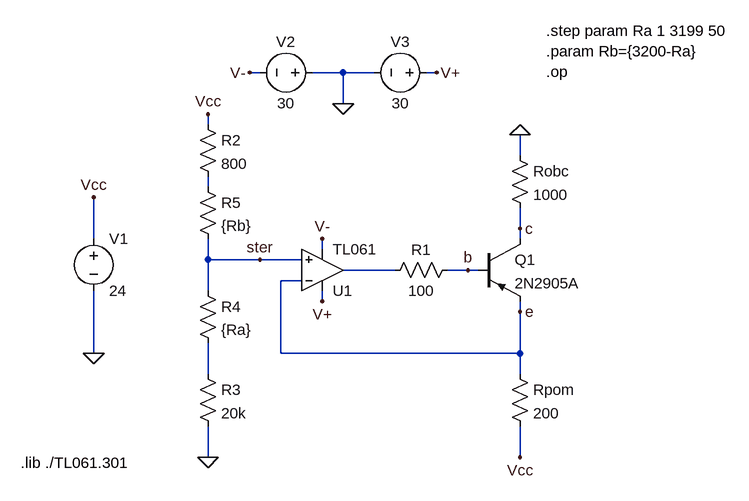
[diagram p0: schematic PNP.asc]
PNP.asc, the LTspice schematic file:
Version 4
SHEET 1 1128 680
WIRE 384 -272 368 -272
WIRE 512 -272 464 -272
WIRE 560 -272 512 -272
WIRE 656 -272 640 -272
WIRE 512 -224 512 -272
WIRE 304 -192 304 -208
WIRE 784 -144 784 -176
WIRE 304 -96 304 -112
WIRE 784 -32 784 -64
WIRE 128 -16 128 -80
WIRE 784 -16 784 -32
WIRE 480 0 480 -16
WIRE 304 16 304 -16
WIRE 384 16 304 16
WIRE 448 16 384 16
WIRE 592 32 512 32
WIRE 704 32 672 32
WIRE 720 32 704 32
WIRE 448 48 416 48
WIRE 304 64 304 16
WIRE 480 80 480 64
WIRE 784 96 784 80
WIRE 128 160 128 64
WIRE 416 160 416 48
WIRE 784 160 784 96
WIRE 784 160 416 160
WIRE 304 192 304 144
WIRE 784 192 784 160
WIRE 304 320 304 272
WIRE 784 320 784 272
FLAG 128 -80 Vcc
FLAG 128 160 0
FLAG 512 -224 0
FLAG 656 -272 V+
FLAG 368 -272 V-
FLAG 480 -16 V-
FLAG 480 80 V+
FLAG 784 96 e
FLAG 784 -32 c
FLAG 704 32 b
FLAG 784 -176 0
FLAG 784 320 Vcc
FLAG 384 16 ster
FLAG 304 320 0
FLAG 304 -208 Vcc
SYMBOL voltage 128 -32 R0
WINDOW 123 0 0 Left 0
WINDOW 39 0 0 Left 0
SYMATTR InstName V1
SYMATTR Value 24
SYMBOL voltage 480 -272 R90
WINDOW 0 -32 56 VBottom 2
WINDOW 3 32 56 VTop 2
WINDOW 123 0 0 Left 0
WINDOW 39 0 0 Left 0
SYMATTR InstName V2
SYMATTR Value 30
SYMBOL voltage 656 -272 R90
WINDOW 0 -32 56 VBottom 2
WINDOW 3 32 56 VTop 2
WINDOW 123 0 0 Left 0
WINDOW 39 0 0 Left 0
SYMATTR InstName V3
SYMATTR Value 30
SYMBOL res 768 -160 R0
SYMATTR InstName Robc
SYMATTR Value 1000
SYMBOL res 768 176 R0
SYMATTR InstName Rpom
SYMATTR Value 200
SYMBOL res 688 16 R90
WINDOW 0 0 56 VBottom 2
WINDOW 3 32 56 VTop 2
SYMATTR InstName R1
SYMATTR Value 100
SYMBOL res 288 -208 R0
SYMATTR InstName R2
SYMATTR Value 800
SYMBOL res 288 176 R0
SYMATTR InstName R3
SYMATTR Value 20k
SYMBOL res 288 48 R0
SYMATTR InstName R4
SYMATTR Value {Ra}
SYMBOL res 288 -112 R0
SYMATTR InstName R5
SYMATTR Value {Rb}
SYMBOL pnp 720 -16 R0
SYMATTR InstName Q1
SYMATTR Value 2N2905A
SYMBOL OpAmps\\opamp2 480 96 M180
SYMATTR InstName U1
SYMATTR Value TL061
TEXT 16 328 Left 2 !.lib ./TL061.301
TEXT 824 -336 Left 2 !.step param Ra 1 3199 50\n.param Rb={3200-Ra}\n.op

The netlist it stands for:
* PNP.asc
V1 Vcc 0 24
V2 0 V- 30
V3 V+ 0 30
Robc 0 c 1000
Rpom e Vcc 200
R1 b N002 100
R2 Vcc N001 800
R3 N003 0 20k
R4 ster N003 {Ra}
R5 N001 ster {Rb}
Q1 c b e 0 2N2905A
XU1 ster e V+ V- N002 TL061  ; pins In+ In- V+ V- OUT
.model NPN NPN
.model PNP PNP
.lib standard.bjt
.lib ./TL061.301
.step param Ra 1 3199 50
.param Rb={3200-Ra}
.op
.backanno
.end

* Results of the author's LTspice run, read from the files saved beside the schematic
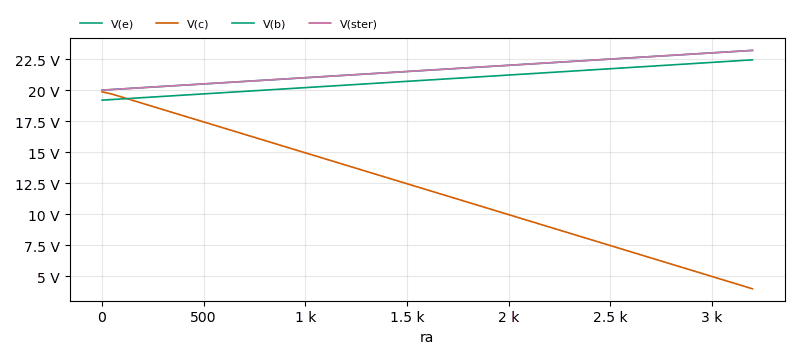
[diagram p1: Operating Point of PNP.asc, plotted from the saved traces]
* Operating Point, 1 run:
*   V(e): 20 V at ra=1 , 23.19 V at ra=3.199 k, min 20 V, max 23.19 V
*   V(c): 19.86 V at ra=1 , 4.01 V at ra=3.199 k, min 4.01 V, max 19.86 V
*   V(b): 19.19 V at ra=1 , 22.44 V at ra=3.199 k, min 19.19 V, max 22.44 V
*   V(ster): 20 V at ra=1 , 23.2 V at ra=3.199 k, min 20 V, max 23.2 V
* From the log:
*   Semiconductor Device Operating Points:
*                           --- Diodes ---
*   Name:    d:u1:p      d:u1:ln     d:u1:lp     d:u1:e      d:u1:c
*   Model:    u1:dx       u1:dx       u1:dx       u1:dx       u1:dx
*   Id:     -6.00e-11   -1.49e-11   -1.51e-11   -4.70e-11   -8.62e-12
*   Vd:     -6.00e+01   -1.49e+01   -1.51e+01   -4.70e+01   -8.62e+00
*   Req:     1.00e+12    1.00e+12    1.00e+12    1.00e+12    1.00e+12
*   CAP:     0.00e+00    0.00e+00    0.00e+00    0.00e+00    0.00e+00
*                           --- Bipolar Transistors ---
*   Name:       q1
*   Model:    2n2905a
*   Ib:      -1.48e-04
*   Ic:      -1.99e-02
*   Vbe:     -8.06e-01
*   Vbc:     -6.72e-01
*   Vce:     -1.33e-01
*   BetaDC:   1.34e+02
*   Gm:       7.56e-01
*   Rpi:      2.88e+02
*   Rx:       1.00e+01
*   Ro:       1.26e+02
*   Cbe:      4.98e-10
*   Cbc:      9.13e-10
*   Cjs:      0.00e+00
*   BetaAC:   2.18e+02
*   Cbx:      0.00e+00
*   Ft:       8.53e+07
*                           --- JFET Transistors ---
*   Name:    j:u1:2      j:u1:1
*   Model:    u1:jx       u1:jx
*   Id:     -2.35e-05   -2.39e-05
*   Vgs:     5.16e-01    5.13e-01
*   Vds:    -4.92e+01   -4.92e+01
*   Gm:      9.73e-05    9.79e-05
*   Gds:     0.00e+00    0.00e+00
*   Cgs:     0.00e+00    0.00e+00
*   Cgd:     0.00e+00    0.00e+00